# Altium schematic sheet 15V7A.SchDoc
size A; SheetNumber: 1; SheetTotal: 1
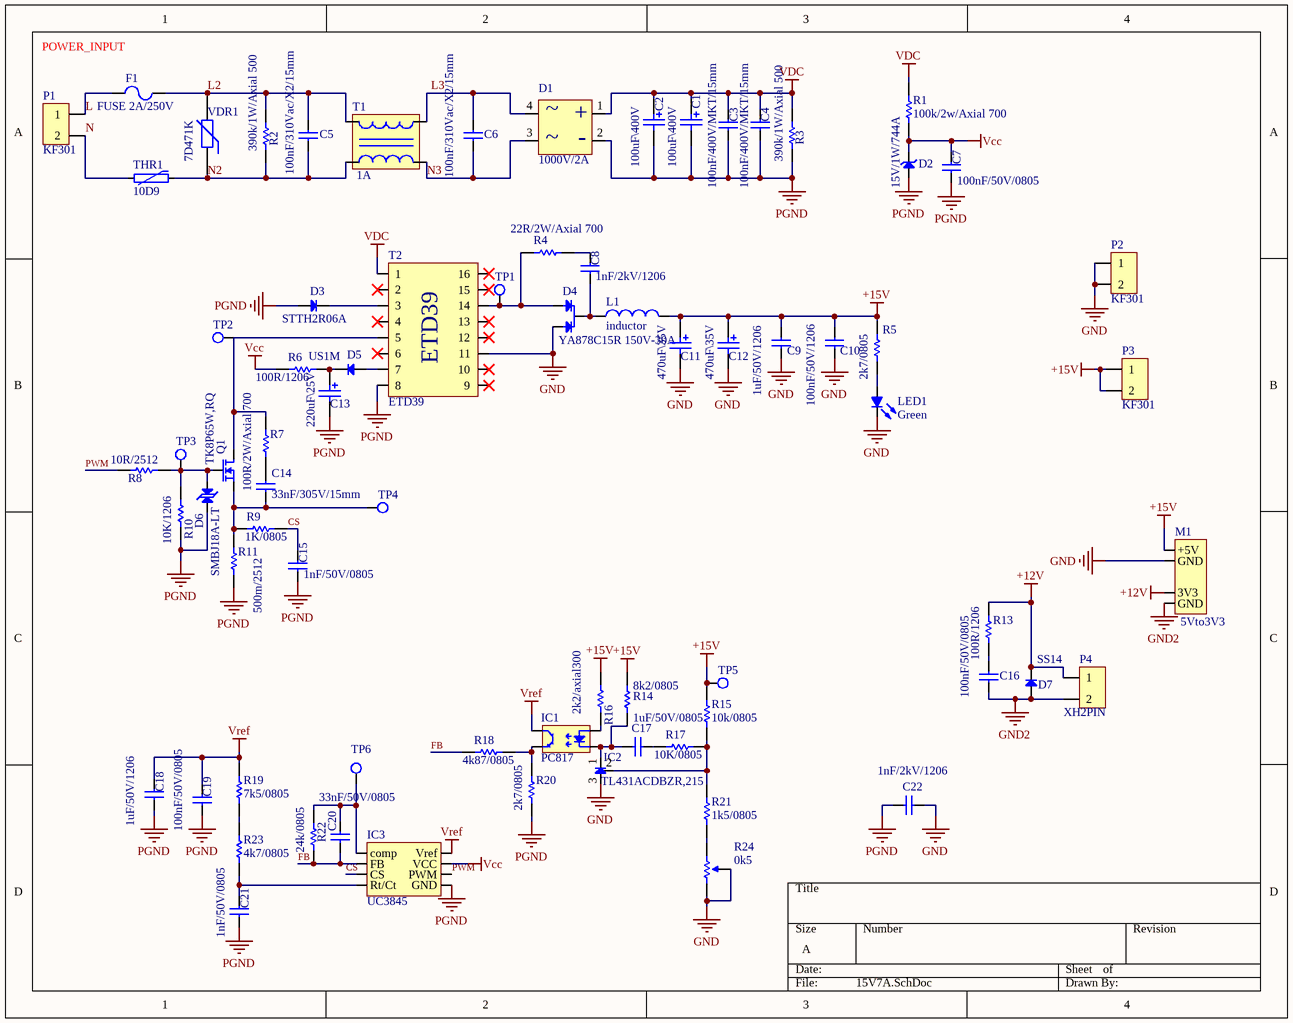
[diagram p0: 15V7A.SchDoc]

## Parts
C1  100uF\400V  [18.5x31 p = 7.5]
C2  100uF\400V  [18.5x31 p = 7.5]
C3  100nF/400V/MKT/15mm  [18.4x7.5 p =15]
C4  100nF/400V/MKT/15mm  [18.4x7.5 p =15]
C5  100nF/310Vac/X2/15mm  [0.1uF/275VAC/X@/15mm]
C6  100nF/310Vac/X2/15mm  [0.1uF/275VAC/X@/15mm]
C7  100nF/50V/0805  [CAP 0805]
C8  1nF/2kV/1206  [CAP 1206]
C9  1uF/50V/1206  [CAP 1206]
C10  100nF/50V/1206  [CAP 1206]
C11  470uF\35V  [10x12 p = 5]
C12  470uF\35V  [10x12 p = 5]
C13  220uF\25V  [cap 5*11,p=2]
C14  33nF/305V/15mm  [0.1uF/275VAC/X@/15mm]
C15  1nF/50V/0805  [CAP 0805]
C16  100nF/50V/0805  [CAP 0805]
C17  1uF/50V/0805  [CAP 0805]
C18  1uF/50V/1206  [CAP 1206]
C19  100nF/50V/0805  [CAP 0805]
C20  33nF/50V/0805  [CAP 0805]
C21  1nF/50V/0805  [CAP 0805]
C22  1nF/2kV/1206  [CAP 1206]
D1  1000V/2A  [ABS210]
D2  15V/1W/744A  [SMA]
D3  STTH2R06A  [SMA]
D4  YA878C15R 150V-30A  [TO-220]
D5  US1M  [SMA]
D6  SMBJ18A-LT  [SMB(DO-214AA)]
D7  SS14  [SMA]
F1  FUSE 2A/250V  [smd Fuse Block 155 OMNI-BLOK]
IC1  PC817  [pc817]
IC2  TL431ACDBZR,215  [SOT-23]
IC3  UC3845  [SO8]
L1  inductor  [50uh/kt130-26]
LED1  COLOR: Green  [LED 3mm]  (hidden comment: LED 3mm/Green)
M1  5Vto3V3  [5Vto3V3]
P1  KF301  [KF301-5.0-2P]
P2  KF301  [KF301-5.0-2P]
P3  KF301  [KF301-5.0-2P]
P4  XH2PIN  [XH-2Pin]
Q1  TK8P65W,RQ  [DPAK-3]
R1  100k/2w/Axial 700  [Axial 0.7]
R2  390k/1W/Axial 500  [RES 2512]
R3  390k/1W/Axial 500  [RES 2512]
R4  22R/2W/Axial 700  [Axial 0.7]
R5  2k7/0805  [RES 0805]
R6  100R/1206  [RES 1206]
R7  100R/2W/Axial 700  [Axial 0.7]
R8  10R/2512  [RES 2512]
R9  1K/0805  [RES 0805]
R10  10K/1206  [RES 1206]
R11  500m/2512  [RES 1206]
R13  100R/1206  [RES 1206]
R14  8k2/0805  [RES 0805]
R15  10k/0805  [RES 0805]
R16  2k2/axial300  [Axial 0.3]
R17  10K/0805  [RES 0805]
R18  4k87/0805  [RES 0805]
R19  7k5/0805  [RES 0805]
R20  2k7/0805  [RES 0805]
R21  1k5/0805  [RES 0805]
R22  24k/0805  [RES 0805]
R23  4k7/0805  [RES 0805]
R24  0k5  [trimmer resistor thd]
T1  1A  [UF 10]
T2  ETD39  [ETD39 - forward]
THR1  10D9  [10D9]
TP1  (no value)  [TP]
TP2  (no value)  [TP]
TP3  (no value)  [TP]
TP4  (no value)  [TP]
TP5  (no value)  [TP]
TP6  (no value)  [TP]
VDR1  7D471K  [7D471K]

## Nets
+12V: D7.2 M1.3(3V3) P4.1 R13.1
+15V: C9.2(-) C10.2(-) C11.1 C12.1 L1.2 M1.1(+5V) P3.1 P3.2 R5.1 R14.1 R15.1 R16.1 TP5.1
GND: C9.1(+) C10.1(+) C11.2 C12.2 C22.1(+) D4.1 IC2.3(Anode) LED1.2(K) M1.2(GND) P2.1 P2.2 R24.2 R24.3 T2.11
GND2: C16.1(+) D7.1 M1.4(GND) P4.2
PGND: C1.2 C2.2 C3.1(+) C4.1(+) C7.1(+) C13.2 C15.1(+) C18.1(+) C19.1(+) C21.1(+) C22.2(-) D1.2 D2.1(A) D3.1 D6.2 IC3.5(GND) R3.1 R10.2 R11.2 R20.2 T2.8
Vcc: C7.2(-) D2.2(K) IC3.7(VCC) R1.2 R6.1
VDC: C1.1 C2.1 C3.2(-) C4.2(-) D1.1 R1.1 R3.2 T2.1
Vref: C18.2(-) C19.2(-) IC1.4(Collector) IC3.8(Vref) R19.1
CS: C15.2(-) IC3.3(CS) R9.1
FB: C20.1(+) IC3.2(FB) R18.1 R22.2
L: F1.2 P1.1
L2: C5.1(+) F1.1 R2.2 T1.1 VDR1.2
L3: C6.2(-) D1.4 T1.4
N: P1.2 THR1.2
N2: C5.2(-) R2.1 T1.2 THR1.1 VDR1.1
N3: C6.1(+) D1.3 T1.3
PWM: IC3.6(PWM) R8.1
NetC8_1: C8.1(+) D4.2 L1.1
NetC8_2: C8.2(-) R4.1
NetC13_1: C13.1 D5.2 R6.2
NetC14_1: C14.1(+) Q1.3(S) R9.2 R11.1 TP4.1
NetC14_2: C14.2(-) R7.2
NetC16_2: C16.2(-) R13.2
NetC17_1: C17.1(+) R17.1
NetC17_2: C17.2(-) IC1.2(Cathode) IC2.1(cathode) R14.2
NetC20_2: C20.2(-) IC3.1(comp) R22.1 TP6.1
NetC21_2: C21.2(-) IC3.4(Rt/Ct) R23.2
NetD3_2: D3.2 T2.3
NetD4_3: D4.3 R4.2 T2.14 TP1.1
NetD5_1: D5.1 T2.7
NetD6_1: D6.1 Q1.1(G) R8.2 R10.1 TP3.1
NetIC1_1: IC1.1(Anode) R16.2
NetIC1_3: IC1.3(Emitter) R18.2 R20.1
NetIC2_2: IC2.2(ref) R15.2 R17.2 R21.1
NetLED1_1: LED1.1(A) R5.2
NetQ1_2: Q1.2(D) R7.1 T2.5 TP2.1
NetR19_2: R19.2 R23.1
NetR21_2: R21.2 R24.1

Not connected (* = marked no-connect by the designer): T2 2* 4* 6* 9* 10* 12* 13* 15* 16*

## Notes on the sheet
- POWER_INPUT
- (in symbol br-diode) ~; +; -

## Library data of the parts
C1 C2 C11-C13 = Cap Pol1: Polarized Capacitor (Radial); Published: 8-Jun-2000; LatestRevisionDate: 17-Jul-2002; LatestRevisionNote: Re-released for DXP Platform.; PackageReference: RB7.6-15; Publisher: Altium Limited; PackageDescription: Polarized Capacitor (Radial); 2 Leads
  C1 C2: Value: 100uF\400V
  C11 C12: Value: 470uF\35V
  C13: Value: 220uF\25V
C3-C10 C14-C22 = Capacitor
D1 = br-diode
D2 = ZENER
D3 D5 D7 = Diode
D4 = Diode 2*1 CA
D6 = TVS-BIPOLAR: 18v-20A
F1 = Fuse
IC2 = TL431DBZ
LED1 = LED: Typical LED
P1-P4 = Header 2H: RELAY; LatestRevisionDate: 17-Jul-2002; LatestRevisionNote: Re-released for DXP Platform.; Publisher: Altium Limited
Q1 = Mosfet N-channel
R1-R3 = Res
  R1: value: 100k/2w/Axial 700
  R2 R3: value: 390k/1W/Axial 500
R4-R11 R14-R23 = Res1: Resistor; Published: 8-Jun-2000; LatestRevisionDate: 17-Jul-2002; LatestRevisionNote: Re-released for DXP Platform.; PackageReference: AXIAL-0.3; Publisher: Altium Limited; PackageDescription: Axial Device, Thru-Hole; 2 Leads; 0.3 in Pin Spacing
  R4: Value: 22R/2W/Axial 700
  R5 R20: Value: 2k7/0805
  R6: Value: 100R/1206
  R7: Value: 100R/2W/Axial 700
  R8: Value: 10R/2512
  R9: Value: 1K/0805
  R10: Value: 10K/1206
  R11: Value: 500m/2512
  R14: Value: 8k2/0805
  R15: Value: 10k/0805
  R16: Value: 2k2/axial300
  R17: Value: 10K/0805
  R18: Value: 4k87/0805
  R19: Value: 7k5/0805
  R21: Value: 1k5/0805
  R22: Value: 24k/0805
  R23: Value: 4k7/0805
R13 = Res 0.5 W: value: 100R/1206
R24 = POT
T1 = Line Filter_01: Line Filter
THR1 = NTC
TP1-TP6 = test-point
VDR1 = VARISTOR (VDR): VARISTORS; Manufacturer: china-canada-philipina; Designer: Abbas Basereh; VALUE: xxDxxx; Models: MOV-VDR-COV; Data: 2017-1-5; Link: digikey.com; PUBLISHER: ABBAS BASEREH